# Altium schematic sheet Makit_Car_Kit.SchDoc (part 3 of 3)
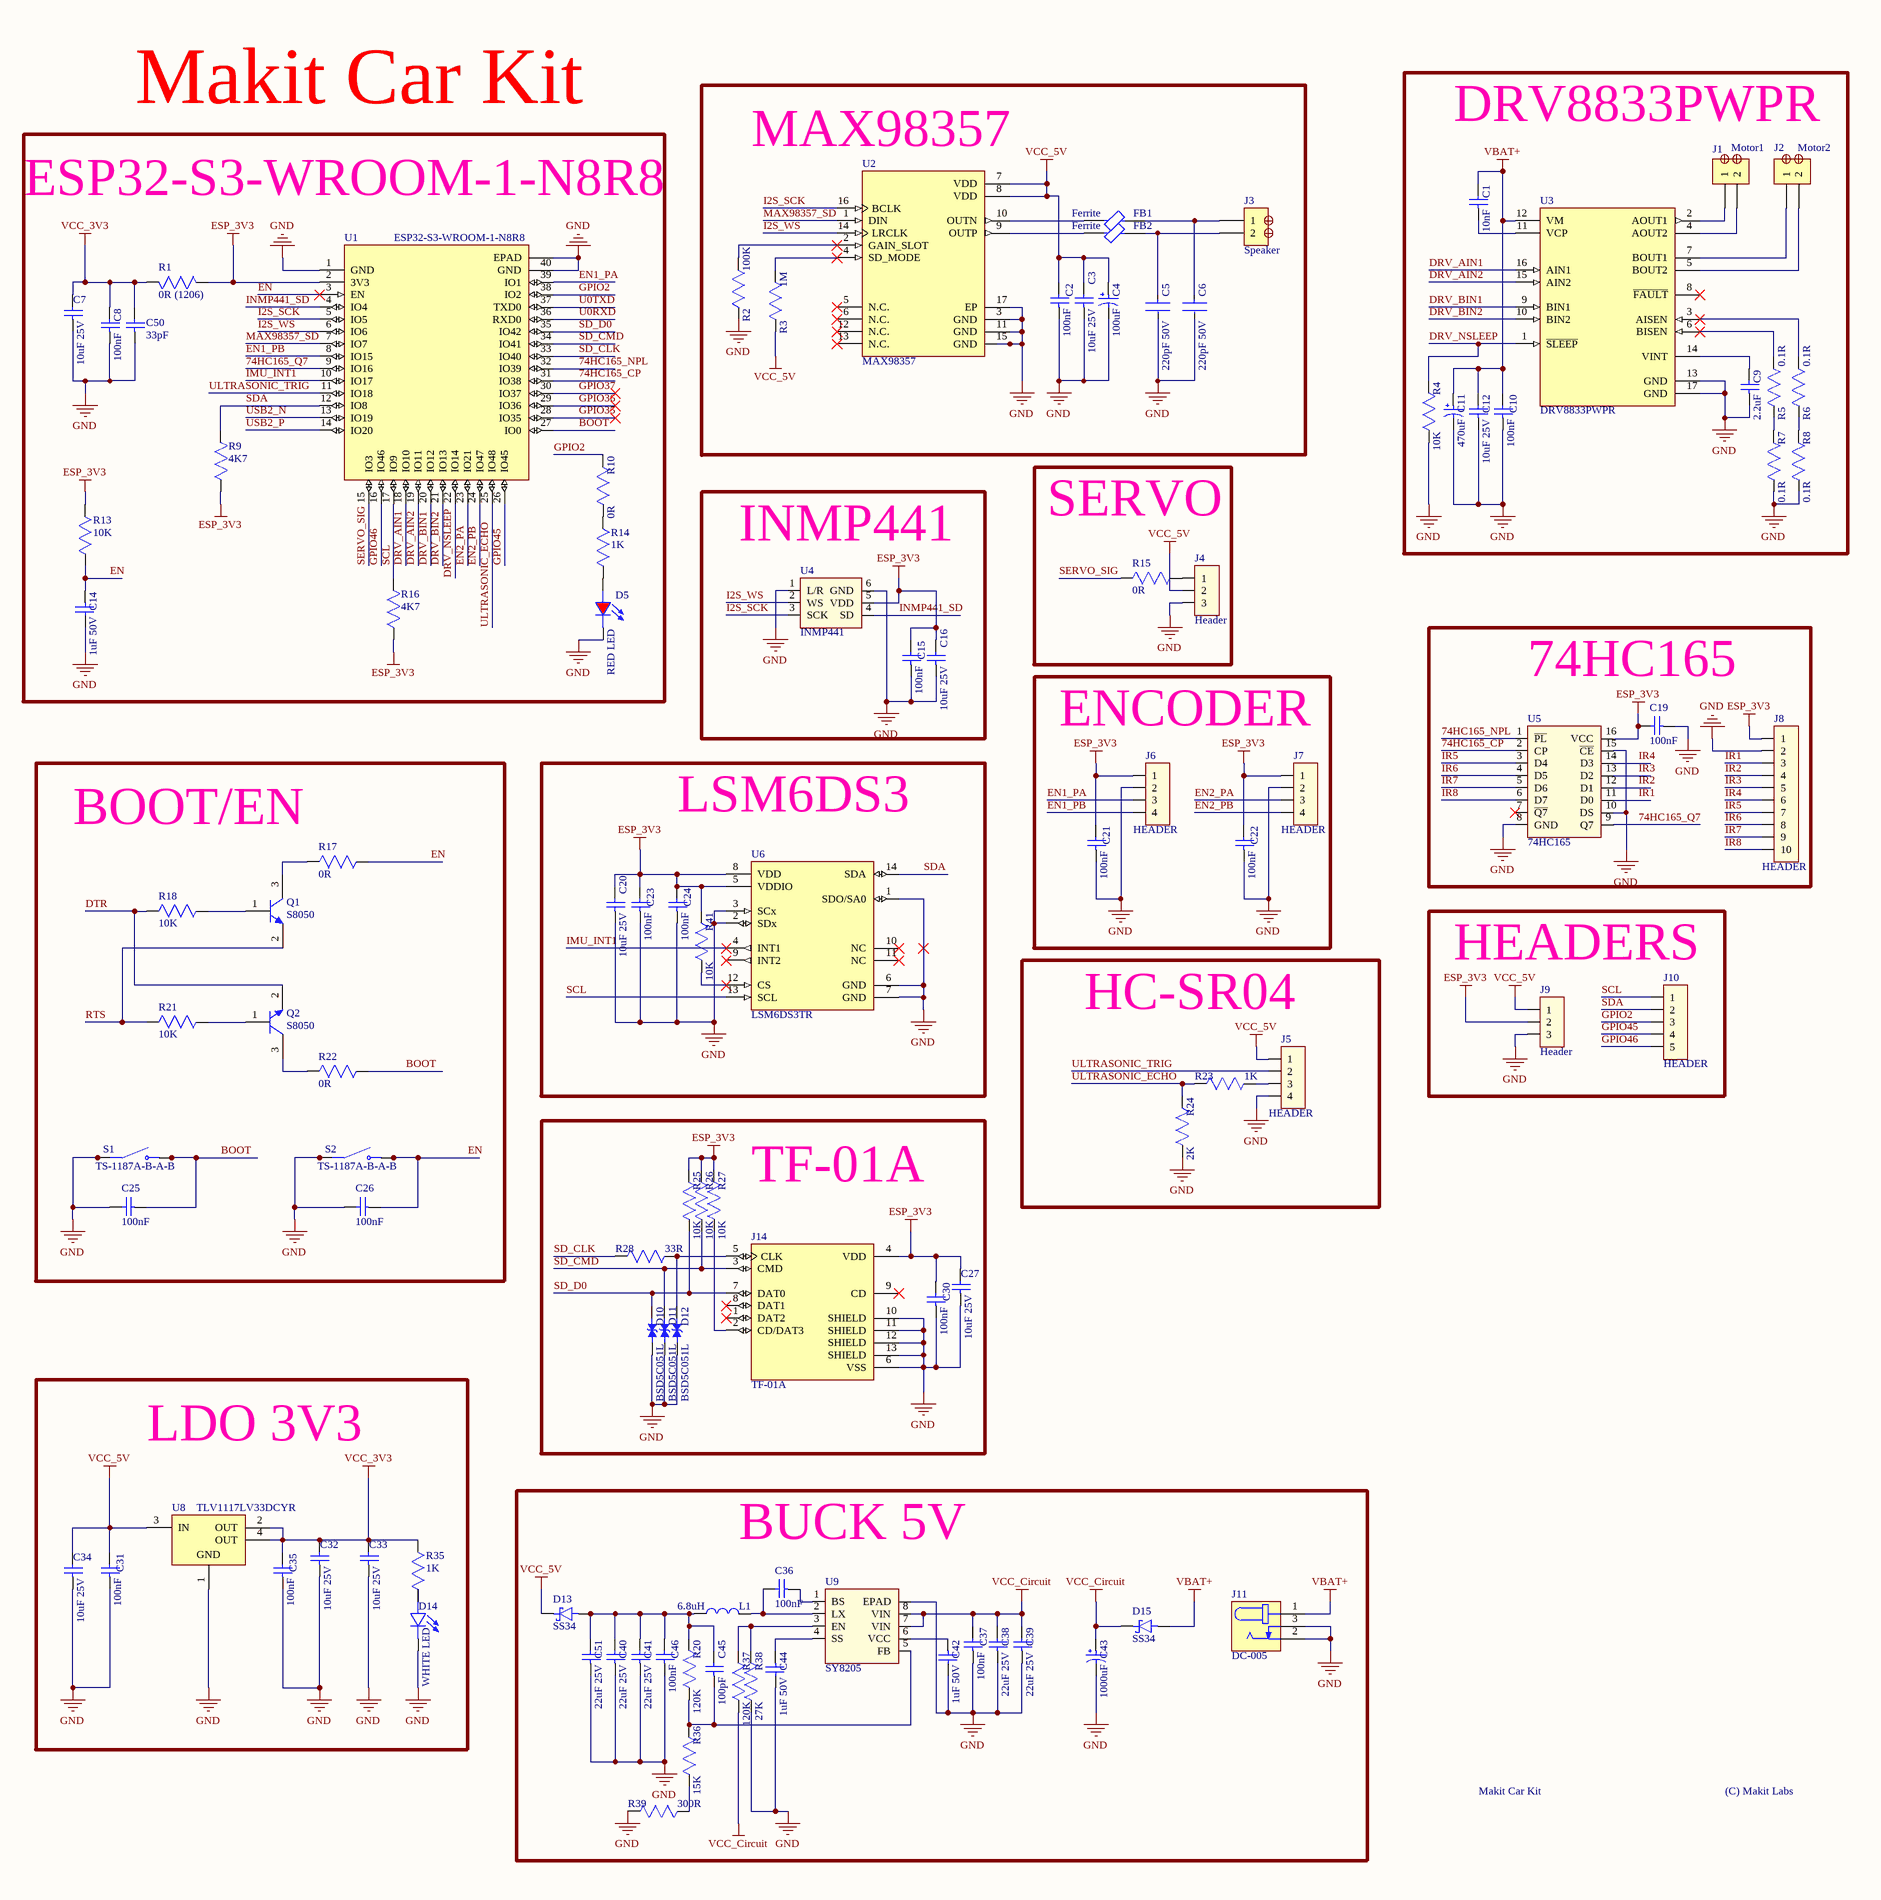
[diagram p3: Makit_Car_Kit.SchDoc, right]

## Library data of the parts (continued)
C50 = CL10C330JB8NNNC: Multilayer Ceramic Capacitor, 33 pF, 50 V, ± 5%, C0G (NP0), 0603 [1608 Metric]; Manufacturer: Samsung Electro-Mechanics; Temperature Coefficient: 30ppm/°C; Voltage: 50V; Supplier: Avnet; Supplier Part Number: CL10C330JB8NNNC; Manufacturer Part Number: CL10C330JB8NNNC; RoHS: Compliant; Category: Ceramic Capacitors; Stock: 164000; Pricing: 4000=0.00469, 8000=0.0046, 16000=0.00451, 32000=0.00442, 64000=0.00434 (USD); Value: 33pF; Case/Package: 0603; Case Code (Imperial): 0603; Case Code (Metric): 1608; China RoHS: Compliant; Contact Plating: Tin; Country of Origin: Mainland China, Philippines, South Korea; Depth: 800µm; Dielectric: C0G; Dielectric Material: Ceramic; Export Control Classification Number (ECCN) Code: EAR99; Height: 900µm; Harmonized Tariff Schedule (HTS) Code: 8532.24.00.20; Introduction Date: 2010-02-10; Lead Free: Lead Free; Length: 1.6mm; Lifecycle Status: Production; Material: Ceramic; Max Operating Temperature: 125°C; Min Operating Temperature: -55°C; Mounting Technology: Surface Mount; Number of Terminals: 2; Radiation Hardening: No; REACH SVHC: Yes; Schedule B: 8532240020, 8532240020|8532240020|8532240020|8532240020|8532240020; Thickness: 889µm; Tolerance: 5%; Voltage Rating: 50V; Voltage Rating (DC): 50V; Width: 800µm; ComponentLink1URL: https://datasheet.octopart.com:443/CL10C330JB8NNNC-Samsung-Electro-Mechanics-datasheet-136482426.pdf?src-supplier=IHS; ComponentLink1Description: https://datasheet.octopart.com:443/CL10C330JB8NNNC-Samsung-Electro-Mechanics-datasheet-136482426.pdf?src-supplier=IHS; ComponentLink2URL: https://datasheet.octopart.com/CL10C330JB8NNNC-Samsung-Electro-Mechanics-datasheet-8324245.pdf; ComponentLink2Description: https://datasheet.octopart.com/CL10C330JB8NNNC-Samsung-Electro-Mechanics-datasheet-8324245.pdf; ComponentLink3URL: https://datasheet.octopart.com/CL10C330JB8NNNC-Samsung-Electro-Mechanics-datasheet-97040617.pdf; ComponentLink3Description: https://datasheet.octopart.com/CL10C330JB8NNNC-Samsung-Electro-Mechanics-datasheet-97040617.pdf; ComponentLink4URL: https://datasheet.octopart.com:443/CL10C330JB8NNNC-Samsung-Electro-Mechanics-datasheet-110226363.pdf?src-supplier=Future+Electronics; ComponentLink4Description: https://datasheet.octopart.com:443/CL10C330JB8NNNC-Samsung-Electro-Mechanics-datasheet-110226363.pdf?src-supplier=Future+Electronics; ComponentLink5URL: https://datasheet.octopart.com:443/CL10C330JB8NNNC-Samsung-Electro-Mechanics-datasheet-81462031.pdf?src-supplier=Future+Electronics; ComponentLink5Description: https://datasheet.octopart.com:443/CL10C330JB8NNNC-Samsung-Electro-Mechanics-datasheet-81462031.pdf?src-supplier=Future+Electronics; ComponentLink6URL: https://datasheet.octopart.com:443/CL10C330JB8NNNC-Samsung-datasheet-42280639.pdf?src-supplier=Future+Electronics; ComponentLink6Description: https://datasheet.octopart.com:443/CL10C330JB8NNNC-Samsung-datasheet-42280639.pdf?src-supplier=Future+Electronics; ComponentLink7URL: https://datasheet.octopart.com:443/CL10C330JB8NNNC-Samsung-datasheet-26669168.pdf?src-supplier=Future+Electronics; ComponentLink7Description: https://datasheet.octopart.com:443/CL10C330JB8NNNC-Samsung-datasheet-26669168.pdf?src-supplier=Future+Electronics; ComponentLink8URL: https://datasheet.octopart.com:443/CL10C330JB8NNNC-Samsung-Electro-Mechanics-datasheet-149136915.pdf?src-supplier=Future+Electronics; ComponentLink8Description: https://datasheet.octopart.com:443/CL10C330JB8NNNC-Samsung-Electro-Mechanics-datasheet-149136915.pdf?src-supplier=Future+Electronics; ComponentLink9URL: https://datasheet.octopart.com:443/CL10C330JB8NNNC-Samsung-datasheet-8326407.pdf?src-supplier=TME; ComponentLink9Description: https://datasheet.octopart.com:443/CL10C330JB8NNNC-Samsung-datasheet-8326407.pdf?src-supplier=TME; JLCPCB Part Number: C1663
D2-D4 D10-D12 = BSD5C051L: 1 13V 150nA 2.5pF 3A@8/20us 5V 6V Bidirectional ESD IEC 61000-4-2、IEC 61000-4-5、IEC 61000-4-4 SOD-523 ESD and Surge Protection (TVS/ESD) ROHS; MF: Leshan Radio Co.; Check_prices: https://www.snapeda.com/parts/LESD5D5.0CT1G/Leshan+Radio+Co./view-part/?ref=eda; Value: *; Availability: Not in stock; Package: None; SnapEDA_Link: https://www.snapeda.com/parts/LESD5D5.0CT1G/Leshan+Radio+Co./view-part/?ref=snap; MP: BSD5C051L; Price: None; JLCPCB Part Number: C151983
D5 = KT-0603R: Red 0603 Light Emitting Diodes; MF: Hubei KENTO Elec; SnapEDA_Link: https://www.snapeda.com/parts/KT-0603R/Hubei+KENTO+Elec/view-part/?ref=snap; Package: Package; MP: KT-0603R; Check_prices: https://www.snapeda.com/parts/KT-0603R/Hubei+KENTO+Elec/view-part/?ref=eda; JLCPCB Part Number: C2286; Value: *
D14 = KT-0603W: White 0603 Light Emitting Diodes; MF: Hubei KENTO Elec; SnapEDA_Link: https://www.snapeda.com/parts/KT-0603R/Hubei+KENTO+Elec/view-part/?ref=snap; Package: Package; MP: KT-0603W; Check_prices: https://www.snapeda.com/parts/KT-0603R/Hubei+KENTO+Elec/view-part/?ref=eda; JLCPCB Part Number: C2290; Value: *
FB1 FB2 = CMP-0686-00557-7: Chip Ferrite Bead, 0603, 120Ω @ 100MHz, 0.05Ω, 25%, 2A; Manufacturer Part Number: BLM18PG121SN1D; Impedance: 120R; Number of Circuits: 1; Shielding: Unshielded; Material: Steel; DC Resistance (DCR): 50mR; Case Code (Imperial): 0603; RoHS Compliant: Yes; Number of Pins: 2; Min Operating Temperature: -55°C; Case Code (Metric): 1608; Frequency: 100MHz; Length: 1.6mm; Test Frequency: 100MHz; Max Operating Temperature: 125°C; Packaging: Tape and Reel; Max Current Rating: 2A; Termination: SMD/SMT; Lead Free: Lead Free; Max DC Current: 2A; Case/Package: 0603; Height: 0.8mm; Current Rating: 2A; Radiation Hardening: No; Core Material: Ferrite; DC Current: 2A; REACH SVHC: No SVHC; Package Quantity: 1; Depth: 0.8mm; Number of Lines: 1; Tolerance: 25%; Width: 0.8mm; JLCPCB Part Number: C14709
J1-J3 = 282837-2: Connector, Terminal Block; Wire Receptacle; 2 Pos.; 16-30 AWG; 0.2 in. CL; Side;; Manufacturer: TE Connectivity; Manufacturer Lifecycle Status: ACTIVE; Approvals: UL; Connector System: Wire-to-Board; Current: 13.5A; Gender: Female; Max Supply Voltage (AC): 250V; Number of Circuits: 2; Number of Levels: 1; Operating Supply Voltage: 300V; Pitch: 5.08mm; Plating: Brass; Tail Length: 3.5mm; Thread Size: M3; Wire/Cable Gauge: 15AWG; Wire Gauge (Max): 28AWG; Wire Gauge (Min): 16AWG; Supplier: Future Electronics; Supplier Part Number: 6910608; Manufacturer Part Number: 282837-2; RoHS: Compliant; Category: Terminal Blocks; Stock: 9; Pricing: 50=0.355, 125=0.345, 250=0.34, 750=0.335, 1500=0.325 (USD); China RoHS: Non-Compliant; Color: Green; Connector Type: Receptacle; Contact Material: Brass; Contact Plating: Tin; Current Rating: 13.5A; Depth: 8.2mm; Export Control Classification Number (ECCN) Code: EAR99; ELV: Compliant; Flammability Rating: UL94 V-0; Height: 10.3mm; Housing Color: Green; Housing Material: Polyamide; Harmonized Tariff Schedule (HTS) Code: 8536.90.40.00; Introduction Date: 1997-11-01; Lead Free: Lead Free; Lifecycle Status: Production; Max Current Rating: 13.5A; Max Operating Temperature: 110°C; Max Voltage Rating (AC): 250V; Min Operating Temperature: -40°C; Mounting Technology: Screw; Number of Contacts: 2; Pins: 2; Number of Poles: 2; Number of Positions: 2; Number of Positions Per Level: 2; Number of Rows: 1; Orientation: Straight; Packaging: Bulk; Radiation Hardening: No; REACH SVHC: No; Termination: Solder; Voltage: 300V; Voltage Rating: 300V; Voltage Rating (AC): 250V; Width: 11.5mm; ComponentLink1URL: https://datasheet.octopart.com:443/282837-2-TE-Connectivity-datasheet-11084709.pdf?src-supplier=Electro+Sonic; ComponentLink1Description: https://datasheet.octopart.com:443/282837-2-TE-Connectivity-datasheet-11084709.pdf?src-supplier=Electro+Sonic; ComponentLink2URL: https://datasheet.octopart.com:443/282837-2-TE-Connectivity-datasheet-180047323.pdf?src-supplier=IHS; ComponentLink2Description: https://datasheet.octopart.com:443/282837-2-TE-Connectivity-datasheet-180047323.pdf?src-supplier=IHS; ComponentLink3URL: https://datasheet.octopart.com:443/282837-2-TE-Connectivity---AMP-datasheet-181444653.pdf?src-supplier=IHS; ComponentLink3Description: https://datasheet.octopart.com:443/282837-2-TE-Connectivity---AMP-datasheet-181444653.pdf?src-supplier=IHS; ComponentLink4URL: https://sigma.octopart.com:443/136669779/technical_drawing/TE-Connectivity-282837-2.pdf?src-supplier=Sager+Electronics; ComponentLink4Description: https://sigma.octopart.com:443/136669779/technical_drawing/TE-Connectivity-282837-2.pdf?src-supplier=Sager+Electronics; ComponentLink5URL: https://datasheet.octopart.com:443/282837-2-TE-Connectivity-datasheet-12103319.pdf?src-supplier=element14+APAC; ComponentLink5Description: https://datasheet.octopart.com:443/282837-2-TE-Connectivity-datasheet-12103319.pdf?src-supplier=element14+APAC; ComponentLink6URL: https://sigma.octopart.com:443/14765542/technical_drawing/TE-Connectivity-282837-2.pdf?src-supplier=TE+Connectivity; ComponentLink6Description: https://sigma.octopart.com:443/14765542/technical_drawing/TE-Connectivity-282837-2.pdf?src-supplier=TE+Connectivity; ComponentLink7URL: https://datasheet.octopart.com:443/282837-2-Agastat-datasheet-13560836.pdf?src-supplier=TE+Connectivity; ComponentLink7Description: https://datasheet.octopart.com:443/282837-2-Agastat-datasheet-13560836.pdf?src-supplier=TE+Connectivity; ComponentLink8URL: https://datasheet.octopart.com:443/282837-2-TE-Connectivity-datasheet-164883459.pdf?src-supplier=Burklin+Elektronik; ComponentLink8Description: https://datasheet.octopart.com:443/282837-2-TE-Connectivity-datasheet-164883459.pdf?src-supplier=Burklin+Elektronik; ComponentLink9URL: https://datasheet.octopart.com:443/282837-2-TE-Connectivity-datasheet-20824500.pdf?src-supplier=RS+(Formerly+Allied+Electronics); ComponentLink9Description: https://datasheet.octopart.com:443/282837-2-TE-Connectivity-datasheet-20824500.pdf?src-supplier=RS+(Formerly+Allied+Electronics); ComponentLink10URL: https://datasheet.octopart.com:443/282837-2-Tyco-Electronics-datasheet-9638290.pdf?src-supplier=RS+(Formerly+Allied+Electronics); ComponentLink10Description: https://datasheet.octopart.com:443/282837-2-Tyco-Electronics-datasheet-9638290.pdf?src-supplier=RS+(Formerly+Allied+Electronics); ComponentLink11URL: https://datasheet.octopart.com:443/282837-2-Tyco-Electronics-datasheet-60025.pdf?src-supplier=RS+(Formerly+Allied+Electronics); ComponentLink11Description: https://datasheet.octopart.com:443/282837-2-Tyco-Electronics-datasheet-60025.pdf?src-supplier=RS+(Formerly+Allied+Electronics); ComponentLink12URL: https://datasheet.octopart.com:443/282837-2-TE-Connectivity---AMP-datasheet-189108469.pdf?src-supplier=Master+Electronics; ComponentLink12Description: https://datasheet.octopart.com:443/282837-2-TE-Connectivity---AMP-datasheet-189108469.pdf?src-supplier=Master+Electronics; ComponentLink13URL: https://datasheet.octopart.com:443/282837-2-TE-Connectivity-datasheet-7829509.pdf?src-supplier=Jameco; ComponentLink13Description: https://datasheet.octopart.com:443/282837-2-TE-Connectivity-datasheet-7829509.pdf?src-supplier=Jameco; ComponentLink14URL: http://sigma.octopart.com:80/38876000/materials_sheet/TE-Connectivity-282837-2.pdf?src-supplier=Compliance+Statements; ComponentLink14Description: http://sigma.octopart.com:80/38876000/materials_sheet/TE-Connectivity-282837-2.pdf?src-supplier=Compliance+Statements; ComponentLink15URL: http://sigma.octopart.com:80/117256993/reach_statement/TE-Connectivity-282837-2.pdf?src-supplier=Compliance+Statements; ComponentLink15Description: http://sigma.octopart.com:80/117256993/reach_statement/TE-Connectivity-282837-2.pdf?src-supplier=Compliance+Statements; ComponentLink16URL: http://sigma.octopart.com:80/136730121/materials_sheet/TE-Connectivity-282837-2.pdf?src-supplier=Compliance+Statements; ComponentLink16Description: http://sigma.octopart.com:80/136730121/materials_sheet/TE-Connectivity-282837-2.pdf?src-supplier=Compliance+Statements; ComponentLink17URL: http://sigma.octopart.com:80/14765540/rohs_certificate/Agastat-282837-2.pdf?src-supplier=Compliance+Statements; ComponentLink17Description: http://sigma.octopart.com:80/14765540/rohs_certificate/Agastat-282837-2.pdf?src-supplier=Compliance+Statements
J4 J9 = HEADER X3
J5-J7 = HEADER X4
J8 = HEADER X10
J10 = HEADER X5
J11 = DC-005: DC Jack; Availability: Unavailable; MP: DC-005; Value: *; Package: None; Price: None
J12 = TYPE-C-31-M-12: -30℃~+80℃ 1 10,000 cycles 16P 20V 5A 7.35mm Female Surface Mount, Right Angle Type-C SMD USB Connectors ROHS; JLCPCB Part Number: C165948; Manufacturer Part Number: TYPE-C-31-M-12
J14 = TF-01A: Standard Card Edge Connectors; MF: HRO Electronics Co., Ltd.; Price: None; Availability: Not in stock; MP: TF-01A; Package: Package; SnapEDA_Link: https://www.snapeda.com/parts/TF-01A/HRO+Electronics+Co.%252C+Ltd./view-part/?ref=snap; Check_prices: https://www.snapeda.com/parts/TF-01A/HRO+Electronics+Co.%252C+Ltd./view-part/?ref=eda; Value: *; Manufacturer_Part_Number: TF-01A; JLCPCB Part Number: C91145
L1 = CYA0650-6.8UH: Manufacturer_Part_Number: CYA0650-6.8UH; Package: SMD,7.2x6.6mm; JLCPCB Part Number: C5189755; Value: 6.8uH
Q1 Q2 = S8050: -55℃~+150℃ 1 NPN 100nA 150MHz 200 25V 300mW 500mA 5V 600mV NPN SOT-23 Bipolar (BJT) ROHS; Package: SOT-23; JLCPCB Part Number: C2146
R1 = CR1206-J-000ELF: -55℃~+155℃ 0Ω 200V 250mW Thick Film Resistor ±1% ±800ppm/℃ 1206 Chip Resistor - Surface Mount ROHS; Manufacturer_Name: Bourns Electronics; Manufacturer_Part_Number: CR1206-J/-000ELF; Copyright: Copyright (C) 2025 Ultra Librarian. All rights reserved.; JLCPCB Part Number: C17888; Value: 0R
R2 = 0603WAF1003T5E: Res Thick Film 0603 100K Ohm 1% 0.1W(1/10W) ±100ppm/C Pad SMD T/R; Manufacturer: Royal Ohm; Value: 100kΩ; Supplier: Mouser; Supplier Part Number: 303-0603WAF1003T5E; Manufacturer Part Number: 0603WAF1003T5E; Category: Uncategorized; Stock: 180000; Pricing: 10000=0.001 (USD); ComponentLink1URL: https://datasheet.octopart.com:443/0603WAF1003T5E-Royal-Ohm-datasheet-165785611.pdf?src-supplier=TME; ComponentLink1Description: https://datasheet.octopart.com:443/0603WAF1003T5E-Royal-Ohm-datasheet-165785611.pdf?src-supplier=TME; ComponentLink2URL: https://datasheet.octopart.com:443/0603WAF1003T5E-Royal-Ohm-datasheet-157855877.pdf?src-supplier=TME; ComponentLink2Description: https://datasheet.octopart.com:443/0603WAF1003T5E-Royal-Ohm-datasheet-157855877.pdf?src-supplier=TME; ComponentLink3URL: https://datasheet.octopart.com:443/0603WAF1003T5E-Royal-Ohm-datasheet-62069544.pdf?src-supplier=TME; ComponentLink3Description: https://datasheet.octopart.com:443/0603WAF1003T5E-Royal-Ohm-datasheet-62069544.pdf?src-supplier=TME; Package: 0603; JLCPCB Part Number: C25803
R3 = 0603WAF1004T5E: Thick Film Resistors - SMD RMC 0603 1/10W 1% T/R-5000; Manufacturer: Royal Ohm; Value: 1MΩ; Supplier: Mouser; Supplier Part Number: 303-0603WAF1004T5E; Manufacturer Part Number: 0603WAF1004T5E; Category: Uncategorized; Stock: 65000; Pricing: 10000=0.001 (USD); ComponentLink1URL: https://datasheet.octopart.com:443/0603WAF1004T5E-Royal-Ohm-datasheet-165785611.pdf?src-supplier=TME; ComponentLink1Description: https://datasheet.octopart.com:443/0603WAF1004T5E-Royal-Ohm-datasheet-165785611.pdf?src-supplier=TME; ComponentLink2URL: https://datasheet.octopart.com:443/0603WAF1004T5E-Royal-Ohm-datasheet-157855877.pdf?src-supplier=TME; ComponentLink2Description: https://datasheet.octopart.com:443/0603WAF1004T5E-Royal-Ohm-datasheet-157855877.pdf?src-supplier=TME; ComponentLink3URL: https://datasheet.octopart.com:443/0603WAF1004T5E-Royal-Ohm-datasheet-62069544.pdf?src-supplier=TME; ComponentLink3Description: https://datasheet.octopart.com:443/0603WAF1004T5E-Royal-Ohm-datasheet-62069544.pdf?src-supplier=TME; Package: 0603; JLCPCB Part Number: C22935
R4 R13 R18 R21 R25-R27 R30 R41 = 0603WAF1002T5E: Res Thick Film 0603 10K Ohm 1% 0.1W(1/10W) ±100ppm/C Pad SMD; Manufacturer: Royal Ohm; Value: 10kΩ; Supplier: Mouser; Supplier Part Number: 303-0603WAF1002T5E; Manufacturer Part Number: 0603WAF1002T5E; Category: Uncategorized; Stock: 375000; Pricing: 10000=0.001 (USD); ComponentLink1URL: https://datasheet.octopart.com:443/0603WAF1002T5E-Royal-Ohm-datasheet-165785611.pdf?src-supplier=TME; ComponentLink1Description: https://datasheet.octopart.com:443/0603WAF1002T5E-Royal-Ohm-datasheet-165785611.pdf?src-supplier=TME; ComponentLink2URL: https://datasheet.octopart.com:443/0603WAF1002T5E-Royal-Ohm-datasheet-157855877.pdf?src-supplier=TME; ComponentLink2Description: https://datasheet.octopart.com:443/0603WAF1002T5E-Royal-Ohm-datasheet-157855877.pdf?src-supplier=TME; ComponentLink3URL: https://datasheet.octopart.com:443/0603WAF1002T5E-Royal-Ohm-datasheet-62069544.pdf?src-supplier=TME; ComponentLink3Description: https://datasheet.octopart.com:443/0603WAF1002T5E-Royal-Ohm-datasheet-62069544.pdf?src-supplier=TME; Package: 0603; JLCPCB Part Number: C25804
R5-R8 = 1206W4F100LT5E: 250mW Thick Film Resistors 200V ±800ppm/℃ ±1% 100mΩ 1206 Chip Resistor - Surface Mount ROHS; Manufacturer: Royal Ohm; Supplier: Mouser; Supplier Part Number: 303-1206W4F100LT5E; Manufacturer Part Number: 1206W4F100LT5E; Category: Uncategorized; Pricing: 10000=0.021 (USD); Value: 100mΩ; ComponentLink1URL: https://datasheet.octopart.com:443/1206W4F100LT5E-Royal-Ohm-datasheet-165785611.pdf?src-supplier=TME; ComponentLink1Description: https://datasheet.octopart.com:443/1206W4F100LT5E-Royal-Ohm-datasheet-165785611.pdf?src-supplier=TME; ComponentLink2URL: https://datasheet.octopart.com:443/1206W4F100LT5E-Royal-Ohm-datasheet-62069544.pdf?src-supplier=TME; ComponentLink2Description: https://datasheet.octopart.com:443/1206W4F100LT5E-Royal-Ohm-datasheet-62069544.pdf?src-supplier=TME; Package: 1206; JLCPCB Part Number: C25334
R9 R16 = 0603WAF4701T5E: 100mW Thick Film Resistors 75V ±100ppm/℃ ±1% 4.7kΩ 0603 Chip Resistor - Surface Mount ROHS; Manufacturer: Royal Ohm; Supplier: Mouser; Supplier Part Number: 303-0603WAF4701T5E; Manufacturer Part Number: 0603WAF4701T5E; Category: Uncategorized; Stock: 165000; Pricing: 10000=0.001 (USD); Value: 4.7kΩ; ComponentLink1URL: https://datasheet.octopart.com:443/0603WAF4701T5E-Royal-Ohm-datasheet-165785611.pdf?src-supplier=TME; ComponentLink1Description: https://datasheet.octopart.com:443/0603WAF4701T5E-Royal-Ohm-datasheet-165785611.pdf?src-supplier=TME; ComponentLink2URL: https://datasheet.octopart.com:443/0603WAF4701T5E-Royal-Ohm-datasheet-157855877.pdf?src-supplier=TME; ComponentLink2Description: https://datasheet.octopart.com:443/0603WAF4701T5E-Royal-Ohm-datasheet-157855877.pdf?src-supplier=TME; ComponentLink3URL: https://datasheet.octopart.com:443/0603WAF4701T5E-Royal-Ohm-datasheet-62069544.pdf?src-supplier=TME; ComponentLink3Description: https://datasheet.octopart.com:443/0603WAF4701T5E-Royal-Ohm-datasheet-62069544.pdf?src-supplier=TME; Package: 0603; JLCPCB Part Number: C23162
R10 R15 R17 R22 R31 R34 = 0603WAF0000T5E: Thick Film Resistors - SMD RMC 0603 1/10W 1% T/R-5000; Manufacturer: Royal Ohm; Value: 0Ω; Supplier: Mouser; Supplier Part Number: 303-0603WAF0000T5E; Manufacturer Part Number: 0603WAF0000T5E; Category: Uncategorized; Stock: 140000; Pricing: 10000=0.001 (USD); ComponentLink1URL: https://datasheet.octopart.com:443/0603WAF0000T5E-Royal-Ohm-datasheet-165785611.pdf?src-supplier=TME; ComponentLink1Description: https://datasheet.octopart.com:443/0603WAF0000T5E-Royal-Ohm-datasheet-165785611.pdf?src-supplier=TME; ComponentLink2URL: https://datasheet.octopart.com:443/0603WAF0000T5E-Royal-Ohm-datasheet-157855877.pdf?src-supplier=TME; ComponentLink2Description: https://datasheet.octopart.com:443/0603WAF0000T5E-Royal-Ohm-datasheet-157855877.pdf?src-supplier=TME; ComponentLink3URL: https://datasheet.octopart.com:443/0603WAF0000T5E-Royal-Ohm-datasheet-62069544.pdf?src-supplier=TME; ComponentLink3Description: https://datasheet.octopart.com:443/0603WAF0000T5E-Royal-Ohm-datasheet-62069544.pdf?src-supplier=TME; Package: 0603; JLCPCB Part Number: C21189
R11 R12 R19 = 0603WAF5101T5E: Res Thick Film 0603 5.1K Ohm 1% 0.1W(1/10W) ±100ppm/C Pad SMD T/R; Manufacturer: Royal Ohm; Value: 5.1kΩ; Supplier: Mouser; Supplier Part Number: 303-0603WAF5101T5E; Manufacturer Part Number: 0603WAF5101T5E; Category: Uncategorized; Stock: 20000; Pricing: 10000=0.001 (USD); ComponentLink1URL: https://datasheet.octopart.com:443/0603WAF5101T5E-Royal-Ohm-datasheet-165785611.pdf?src-supplier=TME; ComponentLink1Description: https://datasheet.octopart.com:443/0603WAF5101T5E-Royal-Ohm-datasheet-165785611.pdf?src-supplier=TME; ComponentLink2URL: https://datasheet.octopart.com:443/0603WAF5101T5E-Royal-Ohm-datasheet-157855877.pdf?src-supplier=TME; ComponentLink2Description: https://datasheet.octopart.com:443/0603WAF5101T5E-Royal-Ohm-datasheet-157855877.pdf?src-supplier=TME; ComponentLink3URL: https://datasheet.octopart.com:443/0603WAF5101T5E-Royal-Ohm-datasheet-62069544.pdf?src-supplier=TME; ComponentLink3Description: https://datasheet.octopart.com:443/0603WAF5101T5E-Royal-Ohm-datasheet-62069544.pdf?src-supplier=TME; Package: 0603; JLCPCB Part Number: C23186
R14 R23 R29 R35 = 0603WAF1001T5E: Res Thick Film 0603 1K Ohm 1% 0.1W(1/10W) ±100ppm/C Pad SMD T/R; Manufacturer: Royal Ohm; Value: 1kΩ; Supplier: Mouser; Supplier Part Number: 303-0603WAF1001T5E; Manufacturer Part Number: 0603WAF1001T5E; Category: Uncategorized; Stock: 275000; Pricing: 10000=0.001 (USD); ComponentLink1URL: https://datasheet.octopart.com:443/0603WAF1001T5E-Royal-Ohm-datasheet-165785611.pdf?src-supplier=TME; ComponentLink1Description: https://datasheet.octopart.com:443/0603WAF1001T5E-Royal-Ohm-datasheet-165785611.pdf?src-supplier=TME; ComponentLink2URL: https://datasheet.octopart.com:443/0603WAF1001T5E-Royal-Ohm-datasheet-157855877.pdf?src-supplier=TME; ComponentLink2Description: https://datasheet.octopart.com:443/0603WAF1001T5E-Royal-Ohm-datasheet-157855877.pdf?src-supplier=TME; ComponentLink3URL: https://datasheet.octopart.com:443/0603WAF1001T5E-Royal-Ohm-datasheet-62069544.pdf?src-supplier=TME; ComponentLink3Description: https://datasheet.octopart.com:443/0603WAF1001T5E-Royal-Ohm-datasheet-62069544.pdf?src-supplier=TME; Package: 0603; JLCPCB Part Number: C21190
R20 R37 = 0603WAF1203T5E: 100mW Thick Film Resistors 75V ±100ppm/℃ ±1% 120kΩ 0603 Chip Resistor - Surface Mount ROHS; Manufacturer: Royal Ohm; Supplier: Mouser; Supplier Part Number: 303-0603WAF1203T5E; Manufacturer Part Number: 0603WAF1203T5E; Category: Uncategorized; Stock: 170000; Pricing: 10000=0.001 (USD); Value: 120kΩ; ComponentLink1URL: https://datasheet.octopart.com:443/0603WAF1203T5E-Royal-Ohm-datasheet-165785611.pdf?src-supplier=TME; ComponentLink1Description: https://datasheet.octopart.com:443/0603WAF1203T5E-Royal-Ohm-datasheet-165785611.pdf?src-supplier=TME; ComponentLink2URL: https://datasheet.octopart.com:443/0603WAF1203T5E-Royal-Ohm-datasheet-157855877.pdf?src-supplier=TME; ComponentLink2Description: https://datasheet.octopart.com:443/0603WAF1203T5E-Royal-Ohm-datasheet-157855877.pdf?src-supplier=TME; ComponentLink3URL: https://datasheet.octopart.com:443/0603WAF1203T5E-Royal-Ohm-datasheet-62069544.pdf?src-supplier=TME; ComponentLink3Description: https://datasheet.octopart.com:443/0603WAF1203T5E-Royal-Ohm-datasheet-62069544.pdf?src-supplier=TME; Package: 0603; JLCPCB Part Number: C25808
R24 = 0603WAF2001T5E: Manufacturer: Royal Ohm; Value: 2kΩ; Supplier: Mouser; Supplier Part Number: 303-0603WAF2001T5E; Manufacturer Part Number: 0603WAF2001T5E; Category: Uncategorized; Stock: 60000; Pricing: 10000=0.001 (USD); ComponentLink1URL: https://datasheet.octopart.com:443/0603WAF2001T5E-Royal-Ohm-datasheet-165785611.pdf?src-supplier=TME; ComponentLink1Description: https://datasheet.octopart.com:443/0603WAF2001T5E-Royal-Ohm-datasheet-165785611.pdf?src-supplier=TME; ComponentLink2URL: https://datasheet.octopart.com:443/0603WAF2001T5E-Royal-Ohm-datasheet-157855877.pdf?src-supplier=TME; ComponentLink2Description: https://datasheet.octopart.com:443/0603WAF2001T5E-Royal-Ohm-datasheet-157855877.pdf?src-supplier=TME; ComponentLink3URL: https://datasheet.octopart.com:443/0603WAF2001T5E-Royal-Ohm-datasheet-62069544.pdf?src-supplier=TME; ComponentLink3Description: https://datasheet.octopart.com:443/0603WAF2001T5E-Royal-Ohm-datasheet-62069544.pdf?src-supplier=TME; Package: 0603; JLCPCB Part Number: C22975
R28 = 0603WAF330JT5E: Thick Film Resistors - SMD RMC 0603 1/10W 1% T/R-5000; Manufacturer: Royal Ohm; Value: 33Ω; Supplier: Mouser; Supplier Part Number: 303-0603WAF330JT5E; Manufacturer Part Number: 0603WAF330JT5E; Category: Uncategorized; Stock: 55000; Pricing: 10000=0.001 (USD); ComponentLink1URL: https://datasheet.octopart.com:443/0603WAF330JT5E-Royal-Ohm-datasheet-165785611.pdf?src-supplier=TME; ComponentLink1Description: https://datasheet.octopart.com:443/0603WAF330JT5E-Royal-Ohm-datasheet-165785611.pdf?src-supplier=TME; ComponentLink2URL: https://datasheet.octopart.com:443/0603WAF330JT5E-Royal-Ohm-datasheet-157855877.pdf?src-supplier=TME; ComponentLink2Description: https://datasheet.octopart.com:443/0603WAF330JT5E-Royal-Ohm-datasheet-157855877.pdf?src-supplier=TME; ComponentLink3URL: https://datasheet.octopart.com:443/0603WAF330JT5E-Royal-Ohm-datasheet-62069544.pdf?src-supplier=TME; ComponentLink3Description: https://datasheet.octopart.com:443/0603WAF330JT5E-Royal-Ohm-datasheet-62069544.pdf?src-supplier=TME; Package: 0603; JLCPCB Part Number: C23140
R32 = 0603WAF2202T5E: Res Thick Film 0603 22K Ohm 1% 0.1W(1/10W) ±100ppm/C Pad SMD T/R; Manufacturer: Royal Ohm; Value: 22kΩ; Supplier: Mouser; Supplier Part Number: 303-0603WAF2202T5E; Manufacturer Part Number: 0603WAF2202T5E; Category: Uncategorized; Stock: 70000; Pricing: 10000=0.001 (USD); ComponentLink1URL: https://datasheet.octopart.com:443/0603WAF2202T5E-Royal-Ohm-datasheet-165785611.pdf?src-supplier=TME; ComponentLink1Description: https://datasheet.octopart.com:443/0603WAF2202T5E-Royal-Ohm-datasheet-165785611.pdf?src-supplier=TME; ComponentLink2URL: https://datasheet.octopart.com:443/0603WAF2202T5E-Royal-Ohm-datasheet-157855877.pdf?src-supplier=TME; ComponentLink2Description: https://datasheet.octopart.com:443/0603WAF2202T5E-Royal-Ohm-datasheet-157855877.pdf?src-supplier=TME; ComponentLink3URL: https://datasheet.octopart.com:443/0603WAF2202T5E-Royal-Ohm-datasheet-62069544.pdf?src-supplier=TME; ComponentLink3Description: https://datasheet.octopart.com:443/0603WAF2202T5E-Royal-Ohm-datasheet-62069544.pdf?src-supplier=TME; Package: 0603; JLCPCB Part Number: C31850
R33 = 0603WAF4702T5E: Res Thick Film 0603 47K Ohm 1% 0.1W(1/10W) ±100ppm/C Pad SMD T/R; Manufacturer: Royal Ohm; Value: 47kΩ; Supplier: Mouser; Supplier Part Number: 303-0603WAF4702T5E; Manufacturer Part Number: 0603WAF4702T5E; Category: Uncategorized; Stock: 95000; Pricing: 10000=0.001 (USD); ComponentLink1URL: https://datasheet.octopart.com:443/0603WAF4702T5E-Royal-Ohm-datasheet-165785611.pdf?src-supplier=TME; ComponentLink1Description: https://datasheet.octopart.com:443/0603WAF4702T5E-Royal-Ohm-datasheet-165785611.pdf?src-supplier=TME; ComponentLink2URL: https://datasheet.octopart.com:443/0603WAF4702T5E-Royal-Ohm-datasheet-157855877.pdf?src-supplier=TME; ComponentLink2Description: https://datasheet.octopart.com:443/0603WAF4702T5E-Royal-Ohm-datasheet-157855877.pdf?src-supplier=TME; ComponentLink3URL: https://datasheet.octopart.com:443/0603WAF4702T5E-Royal-Ohm-datasheet-62069544.pdf?src-supplier=TME; ComponentLink3Description: https://datasheet.octopart.com:443/0603WAF4702T5E-Royal-Ohm-datasheet-62069544.pdf?src-supplier=TME; Package: 0603; JLCPCB Part Number: C25819
R36 = 0603WAF1502T5E: Thick Film Resistors - SMD RMC 0603 1/10W 1% T/R-5000; Manufacturer: Royal Ohm; Value: 15kΩ; Supplier: Mouser; Supplier Part Number: 303-0603WAF1502T5E; Manufacturer Part Number: 0603WAF1502T5E; Category: Uncategorized; Stock: 5000; Pricing: 10000=0.001 (USD); ComponentLink1URL: https://datasheet.octopart.com:443/0603WAF1502T5E-Royal-Ohm-datasheet-165785611.pdf?src-supplier=TME; ComponentLink1Description: https://datasheet.octopart.com:443/0603WAF1502T5E-Royal-Ohm-datasheet-165785611.pdf?src-supplier=TME; ComponentLink2URL: https://datasheet.octopart.com:443/0603WAF1502T5E-Royal-Ohm-datasheet-157855877.pdf?src-supplier=TME; ComponentLink2Description: https://datasheet.octopart.com:443/0603WAF1502T5E-Royal-Ohm-datasheet-157855877.pdf?src-supplier=TME; ComponentLink3URL: https://datasheet.octopart.com:443/0603WAF1502T5E-Royal-Ohm-datasheet-62069544.pdf?src-supplier=TME; ComponentLink3Description: https://datasheet.octopart.com:443/0603WAF1502T5E-Royal-Ohm-datasheet-62069544.pdf?src-supplier=TME; Package: 0603; JLCPCB Part Number: C22809
R38 = 0603WAF2702T5E: Thick Film Resistors - SMD RMC 0603 1/10W 1% T/R-5000; Manufacturer: Royal Ohm; Value: 27kΩ; Supplier: Mouser; Supplier Part Number: 303-0603WAF2702T5E; Manufacturer Part Number: 0603WAF2702T5E; Category: Uncategorized; Stock: 100000; Pricing: 10000=0.001 (USD); ComponentLink1URL: https://datasheet.octopart.com:443/0603WAF2702T5E-Royal-Ohm-datasheet-165785611.pdf?src-supplier=TME; ComponentLink1Description: https://datasheet.octopart.com:443/0603WAF2702T5E-Royal-Ohm-datasheet-165785611.pdf?src-supplier=TME; ComponentLink2URL: https://datasheet.octopart.com:443/0603WAF2702T5E-Royal-Ohm-datasheet-157855877.pdf?src-supplier=TME; ComponentLink2Description: https://datasheet.octopart.com:443/0603WAF2702T5E-Royal-Ohm-datasheet-157855877.pdf?src-supplier=TME; ComponentLink3URL: https://datasheet.octopart.com:443/0603WAF2702T5E-Royal-Ohm-datasheet-62069544.pdf?src-supplier=TME; ComponentLink3Description: https://datasheet.octopart.com:443/0603WAF2702T5E-Royal-Ohm-datasheet-62069544.pdf?src-supplier=TME; Package: 0603; JLCPCB Part Number: C22967
R39 = 0603WAF3000T5E: 100mW Thick Film Resistors 75V ±100ppm/℃ ±1% 300Ω 0603 Chip Resistor - Surface Mount ROHS; Manufacturer: Royal Ohm; Supplier: Mouser; Supplier Part Number: 303-0603WAF3000T5E; Manufacturer Part Number: 0603WAF3000T5E; Category: Uncategorized; Pricing: 10000=0.001 (USD); Value: 300Ω; ComponentLink1URL: https://datasheet.octopart.com:443/0603WAF3000T5E-Royal-Ohm-datasheet-165785611.pdf?src-supplier=TME; ComponentLink1Description: https://datasheet.octopart.com:443/0603WAF3000T5E-Royal-Ohm-datasheet-165785611.pdf?src-supplier=TME; ComponentLink2URL: https://datasheet.octopart.com:443/0603WAF3000T5E-Royal-Ohm-datasheet-157855877.pdf?src-supplier=TME; ComponentLink2Description: https://datasheet.octopart.com:443/0603WAF3000T5E-Royal-Ohm-datasheet-157855877.pdf?src-supplier=TME; ComponentLink3URL: https://datasheet.octopart.com:443/0603WAF3000T5E-Royal-Ohm-datasheet-62069544.pdf?src-supplier=TME; ComponentLink3Description: https://datasheet.octopart.com:443/0603WAF3000T5E-Royal-Ohm-datasheet-62069544.pdf?src-supplier=TME; Package: 0603; JLCPCB Part Number: C23025
S1 S2 = TS-1187A-B-A-B: SPST 50mA @ 12VDC Top Actuated Round Button 160gf SMD Tactile Switches RoHS; MP: TS-1187A-B-A-B; Value: *; Price: None; Package: None; Availability: Unavailable; JLCPCB Part Number: C318884
U1 = ESP32-S3-WROOM-1-N8R8: Bluetooth, WiFi 802.11b/g/n, Bluetooth v5.0 Transceiver Module 2.4GHz PCB Trace Surface Mount; pin to pad: 41>41_1+41_2+41_3+41_4+41_5+41_6+41_7+41_8+41_9+41_10+41_11+41_12+41_13+41_14+41_15+41_16+41_17+41_18+41_19+41_20+41_21; MF: Espressif Systems; Package: None; Price: None; Check_prices: https://www.snapeda.com/parts/ESP32-S3-WROOM-1-N8R8/Espressif+Systems/view-part/?ref=eda; Value: *; SnapEDA_Link: https://www.snapeda.com/parts/ESP32-S3-WROOM-1-N8R8/Espressif+Systems/view-part/?ref=snap; MP: ESP32-S3-WROOM-1-N8R8; Availability: In Stock; Purchase-URL: https://pricing.snapeda.com/search?q=ESP32-S3-WROOM-1-N8R8&ref=eda
U2 = MAX98357AETE+T: MAX98357A Series 5.5 V 3.2 W PCM Input Class D Audio Power Amplifier - TQFN-16; Manufacturer: Analog Devices; Manufacturer Lifecycle Status: PRODUCTION; Max Junction Temperature (Tj): 150°C; Max Output current: 1.6A; Max Output Power: 3.2W; Max Power Dissipation: 1.666W; Max Supply Voltage: 5.5V; Min Supply Voltage: 2.5V; Number of Channels: 1; Power Supply Rejection Ratio (PSRR): 77dB; Voltage Gain: 15dB; Supplier: Arrow Electronics; Supplier Part Number: MAX98357AETE+T; Manufacturer Part Number: MAX98357AETE+T; RoHS: Compliant; Category: Amplifiers - Audio; Stock: 25000; Pricing: 2500=1.79 (USD); Contact Plating: Tin; Height: 800µm; Lifecycle Status: Production; Max Operating Temperature: 85°C; Min Operating Temperature: -40°C; Mounting Technology: Surface Mount; Pins: 16; Output Power: 3.2W; Packaging: Tape & Reel; Radiation Hardening: No; Schedule B: 8542330000|8542330000|8542330000|8542330000|8542330000|8542330000|8542330000|8542330000|8542330000|8542330000|8542330000|8542330000|8542330000|8542330000|8542330000|8542330000|8542330000|8542330000|8542330000|8542330000|8542330000|8542330000|8542330000|85; ComponentLink1URL: https://octopart.com:443/opatz8j6/c1?t=yNMcU-XKDkN0o8xYTm6URhn_9nIMPsgQBI2xg8KwH08FPVC2Yp0oEBvhVJDvC8BH403lD25RLMIzjaHixokeavaTNiQVrExSZWvE8s6gsZaIo393pUunWghAhyc9gjbEdNTCGxTHPWBUsap5xi9Gu6gxJcYS-WroDv5vRs7YcAlmUrPds1qcg3g8cBoBcp6UucJZouH41N7pn-Wjuljw_0PJOBHrmdg4OBDFIBiilKuMmyQYrtQ3oepzhxq9wijavMwLeH-RY1-oKGgnQ6O4hL2jPF6tDAGh0ittBY25sJCSPs2FuKYzAUL7kSc&src-supplier=Analog+Devices; ComponentLink1Description: https://octopart.com:443/opatz8j6/c1?t=yNMcU-XKDkN0o8xYTm6URhn_9nIMPsgQBI2xg8KwH08FPVC2Yp0oEBvhVJDvC8BH403lD25RLMIzjaHixokeavaTNiQVrExSZWvE8s6gsZaIo393pUunWghAhyc9gjbEdNTCGxTHPWBUsap5xi9Gu6gxJcYS-WroDv5vRs7YcAlmUrPds1qcg3g8cBoBcp6UucJZouH41N7pn-Wjuljw_0PJOBHrmdg4OBDFIBiilKuMmyQYrtQ3oepzhxq9wijavMwLeH-RY1-oKGgnQ6O4hL2jPF6tDAGh0ittBY25sJCSPs2FuKYzAUL7kSc&src-supplier=Analog+Devices; ComponentLink2URL: https://datasheet.octopart.com:443/MAX98357AETE%2BT-Analog-Devices-datasheet-140103828.pdf?src-supplier=Upverter; ComponentLink2Description: https://datasheet.octopart.com:443/MAX98357AETE%2BT-Analog-Devices-datasheet-140103828.pdf?src-supplier=Upverter; ComponentLink3URL: https://datasheet.octopart.com:443/MAX98357AETE%2BT-Maxim-Integrated-datasheet-82537686.pdf?src-supplier=Upverter; ComponentLink3Description: https://datasheet.octopart.com:443/MAX98357AETE%2BT-Maxim-Integrated-datasheet-82537686.pdf?src-supplier=Upverter; ComponentLink4URL: https://sigma.octopart.com:443/141243535/technical_drawing/Maxim-Integrated-MAX98357AETE%2BT.pdf?src-supplier=Upverter; ComponentLink4Description: https://sigma.octopart.com:443/141243535/technical_drawing/Maxim-Integrated-MAX98357AETE%2BT.pdf?src-supplier=Upverter; ComponentLink5URL: https://datasheet.octopart.com:443/MAX98357AETE%2BT-Maxim-Integrated-datasheet-134531866.pdf?src-supplier=Augswan; ComponentLink5Description: https://datasheet.octopart.com:443/MAX98357AETE%2BT-Maxim-Integrated-datasheet-134531866.pdf?src-supplier=Augswan; ComponentLink6URL: https://sigma.octopart.com:443/140082349/technical_drawing/Maxim-Integrated-MAX98357AETE%2BT.pdf?src-supplier=ShanghaiCT; ComponentLink6Description: https://sigma.octopart.com:443/140082349/technical_drawing/Maxim-Integrated-MAX98357AETE%2BT.pdf?src-supplier=ShanghaiCT; ComponentLink7URL: https://datasheet.octopart.com/MAX98357AETE%2BT-Maxim-Integrated-datasheet-38886134.pdf; ComponentLink7Description: https://datasheet.octopart.com/MAX98357AETE%2BT-Maxim-Integrated-datasheet-38886134.pdf; ComponentLink8URL: https://datasheet.octopart.com:443/MAX98357AETE%2BT-Maxim-Integrated-datasheet-8516998.pdf?src-supplier=Future+Electronics; ComponentLink8Description: https://datasheet.octopart.com:443/MAX98357AETE%2BT-Maxim-Integrated-datasheet-8516998.pdf?src-supplier=Future+Electronics; ComponentLink9URL: http://sigma.octopart.com:80/conflict_mineral_statement/Analog-Devices-company-33.pdf?src-supplier=Compliance+Statements; ComponentLink9Description: http://sigma.octopart.com:80/conflict_mineral_statement/Analog-Devices-company-33.pdf?src-supplier=Compliance+Statements; ComponentLink10URL: http://sigma.octopart.com:80/reach_statement/Maxim-Integrated-company-67.pdf?src-supplier=Compliance+Statements; ComponentLink10Description: http://sigma.octopart.com:80/reach_statement/Maxim-Integrated-company-67.pdf?src-supplier=Compliance+Statements; ComponentLink11URL: http://sigma.octopart.com:80/rohs_statement/Maxim-Integrated-company-66.pdf?src-supplier=Compliance+Statements; ComponentLink11Description: http://sigma.octopart.com:80/rohs_statement/Maxim-Integrated-company-66.pdf?src-supplier=Compliance+Statements; ComponentLink12URL: http://sigma.octopart.com:80/conflict_mineral_statement/Maxim-Integrated-company-65.pdf?src-supplier=Compliance+Statements; ComponentLink12Description: http://sigma.octopart.com:80/conflict_mineral_statement/Maxim-Integrated-company-65.pdf?src-supplier=Compliance+Statements; ComponentLink13URL: https://octopart.com:443/opatz8j6/c1?t=Bv0f2BfoFwhohv0un7o9I76aj1Xgk1do5QHf943lLTAxTqEHx7lmJWxQapPRwJ1ZPM2rfGeu9eyIDRKCTRSszAJjc-Y6A6857H2kllxuKAe81eMTjIw00LDOIqYYt6JZWnfvf9QMGuM_YnFFat26XlcKCsZlKGoQx8nEl0G9eghXLw97whAUolrM5eqhMvKf2icvXdkOI4euicsOknz0zqGQGmH642O5ZZoYkcJIVnHvFIEPNikdwc4jUnCaVVIMlMAENlRaq6kb5gSh-48hbdm7PCRa_yqLfIkEbgV7REraBSXS9nqDSCO-wDo&src-supplier=Compliance+Statements; ComponentLink13Description: https://octopart.com:443/opatz8j6/c1?t=Bv0f2BfoFwhohv0un7o9I76aj1Xgk1do5QHf943lLTAxTqEHx7lmJWxQapPRwJ1ZPM2rfGeu9eyIDRKCTRSszAJjc-Y6A6857H2kllxuKAe81eMTjIw00LDOIqYYt6JZWnfvf9QMGuM_YnFFat26XlcKCsZlKGoQx8nEl0G9eghXLw97whAUolrM5eqhMvKf2icvXdkOI4euicsOknz0zqGQGmH642O5ZZoYkcJIVnHvFIEPNikdwc4jUnCaVVIMlMAENlRaq6kb5gSh-48hbdm7PCRa_yqLfIkEbgV7REraBSXS9nqDSCO-wDo&src-supplier=Compliance+Statements
U3 = CMP-1529-00004-3: IC MOTOR DRIVER PAR 16HTSSOP; Supply Current: 3mA; Max Output Current: 2A; Interface: PWM; Output Current: 1.5A; Max Supply Voltage: 10.8V; Fault Protection: Over Temperature; Number of Outputs: 2; Min Supply Voltage: 2.7V; Nominal Supply Current: 3mA; Series: DRV8833; Min Operating Temperature: -40°C; Package Quantity: 2000; Packaging: Tape and Reel; Case/Package: HTSSOP; Output Current per Channel: 1.5A; RoHS Compliant: Yes; RMS Current (Irms): 1.5A; Max Operating Temperature: 85°C; Technology: NMOS; Number of Pins: 16; Radiation Hardening: No; Lead Free: Lead Free; REACH SVHC: No SVHC; JLCPCB Part Number: C50506
U5 = 74HC165PW,118: 74HC Series 6 V 8-Bit Parallel-In/Serial Out Shift Register - TSSOP-16; Manufacturer: Nexperia; Manufacturer Lifecycle Status: RELEASED FOR SUPPLY; Clock Edge Trigger Type: Positive Edge; Direction: Unidirectional; Frequency: 20MHz; Load Capacitance: 50pF; Logic Function: OR, Shift Register; Max Supply Current: 50mA; Max Supply Voltage: 6V; Min Supply Voltage: 2V; Number of Bits: 8; Number of Circuits: 1; Number of Gates: 4; Number of Input Lines: 9; Operating Supply Voltage: 5V; Output Current: 5.2mA; Propagation Delay: 250ns; Quiescent Current: 8µA; Supplier: Avnet; Supplier Part Number: 74HC165PW,118; Manufacturer Part Number: 74HC165PW,118; RoHS: Compliant; Category: Shift Registers; Stock: 252500; Pricing: 2500=0.19757, 5000=0.19267, 10000=0.18992, 20000=0.18715, 40000=0.1844 (USD); Case/Package: TSSOP; China RoHS: Compliant; Contact Plating: Gold; Height - Seated (Max): 1.1mm; Harmonized Tariff Schedule (HTS) Code: 8542.39.00.01; Introduction Date: 1990-12-01; Lead Free: Lead Free; Length: 5mm; Lifecycle Status: Production; Max Operating Temperature: 125°C; Min Operating Temperature: -40°C; Mounting Technology: Surface Mount; Number of Bits per Element: 8; Number of Elements: 1; Number of Inputs: 8; Number of Output Lines: 1; Pins: 16; Number of Terminals: 16; Radiation Hardening: No; REACH SVHC: Yes; Schedule B: 8542390000, 8542390000|8542390000|8542390000|8542390000|8542390000; Temperature Grade: Automotive; Terminal Pitch: 650µm; Turn-On Delay Time: 250ns; Width: 4.4mm; ComponentLink1URL: https://datasheet.octopart.com:443/74HC165PW%2C118-Nexperia-datasheet-80324119.pdf?src-supplier=Augswan; ComponentLink1Description: https://datasheet.octopart.com:443/74HC165PW%2C118-Nexperia-datasheet-80324119.pdf?src-supplier=Augswan; ComponentLink2URL: https://datasheet.octopart.com:443/74HC165PW%2C118-Nexperia-datasheet-540822.pdf?src-supplier=IHS; ComponentLink2Description: https://datasheet.octopart.com:443/74HC165PW%2C118-Nexperia-datasheet-540822.pdf?src-supplier=IHS; ComponentLink3URL: https://datasheet.octopart.com:443/74HC165PW%2C118-Nexperia-datasheet-62067705.pdf?src-supplier=Newark; ComponentLink3Description: https://datasheet.octopart.com:443/74HC165PW%2C118-Nexperia-datasheet-62067705.pdf?src-supplier=Newark; ComponentLink4URL: https://datasheet.octopart.com:443/74HC165PW%2C118-Nexperia-datasheet-180922443.pdf?src-supplier=TME; ComponentLink4Description: https://datasheet.octopart.com:443/74HC165PW%2C118-Nexperia-datasheet-180922443.pdf?src-supplier=TME; ComponentLink5URL: https://datasheet.octopart.com:443/74HC165PW%2C118-NXP-Semiconductors-datasheet-12514615.pdf?src-supplier=element14+APAC; ComponentLink5Description: https://datasheet.octopart.com:443/74HC165PW%2C118-NXP-Semiconductors-datasheet-12514615.pdf?src-supplier=element14+APAC; ComponentLink6URL: https://datasheet.octopart.com:443/74HC165PW%2C118-NXP-Semiconductors-datasheet-15937044.pdf?src-supplier=iiiC; ComponentLink6Description: https://datasheet.octopart.com:443/74HC165PW%2C118-NXP-Semiconductors-datasheet-15937044.pdf?src-supplier=iiiC; ComponentLink7URL: http://sigma.octopart.com:80/reach_statement/NXP-Semiconductors-company-13.pdf?src-supplier=Compliance+Statements; ComponentLink7Description: http://sigma.octopart.com:80/reach_statement/NXP-Semiconductors-company-13.pdf?src-supplier=Compliance+Statements; ComponentLink8URL: http://sigma.octopart.com:80/rohs_statement/NXP-Semiconductors-company-12.pdf?src-supplier=Compliance+Statements; ComponentLink8Description: http://sigma.octopart.com:80/rohs_statement/NXP-Semiconductors-company-12.pdf?src-supplier=Compliance+Statements; JLCPCB Part Number: C80696
U6 = CMP-2000-05193-2: IMU ACCEL/GYRO I2C/SPI 14VFLGA; Manufacturer: STMicroelectronics; Sensor Type: Temperature,Accelerometer,Gyroscope; Gyro Range: 125/250/500/1000/2000°/s; Min Supply Voltage: 1.62V; Operating Supply Current: 9-900uA; Accel Range: 2/4/8/16g; Max Supply Voltage: 3.6V; Sensor Output: I2C,SPI; Package: LGA-14-DM00249496; Automotive: No; Height: 0.86mm; Temperature Range High: +85°C; Device Class L3: Inertial Measurement Units (IMUs); Device Class L2: Motion Sensors; Footprint Url: https://www.st.com/content/ccc/resource/technical/document/technical_note/73/17/9c/16/dd/96/4a/01/CD00134799.pdf/files/CD00134799.pdf/jcr:content/translations/en.CD00134799.pdf; Digikey Description: IMU ACCEL/GYRO I2C/SPI 14VFLGA; Mouser Description: LSM6DS3 Series 3.6 V ±2/±4/±8/±16 g 3D Accelerometer and 3D Gyroscope - LGA-14L; Manufacturer Part Number: LSM6DS3TR; Temperature Range Low: -40°C; RoHS: TRUE; ComponentLink2Description: Datasheet; Device Class L1: Sensors; Lead Free: Yes; Category: IC; Octopart: https://octopart.com/lsm6ds3tr-stmicroelectronics-53586202; Temperature: -40°C to +85°C; ComponentLink2URL: https://www.st.com/resource/en/datasheet/lsm6ds3.pdf; JLCPCB Part Number: C95230
U7 = CP2102N-A02-GQFN28R: Integrated Circuit Interface USB for UART Controller; 3-3.6V; -40+85 deg.C; SMD; QFN28; Manufacturer: Silicon Lab; Manufacturer Lifecycle Status: FULL PRODUCTION; Data Rate: 1.5Mbps; Max Junction Temperature (Tj): 105°C; Max Supply Voltage: 3.6V; Min Supply Voltage: 3V; Number of Digital IO: 7; Number of Ports: 1; Operating Supply Voltage: 3.3V; USB Standard: USB 2.0; Supplier: Arrow Electronics; Supplier Part Number: CP2102N-A02-GQFN28R; Manufacturer Part Number: CP2102N-A02-GQFN28R; RoHS: Compliant; Category: USB Interface ICs; Stock: 1500; Pricing: 1500=2.6814 (USD); Ambient Temperature Range High: 85°C; China RoHS: Compliant; Height: 800µm; Height - Seated (Max): 800µm; Harmonized Tariff Schedule (HTS) Code: 8542.31.00.30; Interface: UART; Introduction Date: 2019-03-12; Length: 5mm; Lifecycle Status: Production; Max Operating Temperature: 85°C; Min Operating Temperature: -40°C; Number of Terminals: 28; REACH SVHC: Yes; Schedule B: 8542390000, 8542390000|8542390000|8542390000|8542390000|8542390000; Temperature Grade: Industrial; Terminal Pitch: 500µm; Width: 5mm; ComponentLink1URL: https://datasheet.octopart.com:443/CP2102N-A02-GQFN28R-Silicon-Labs-datasheet-138898368.pdf?src-supplier=Augswan; ComponentLink1Description: https://datasheet.octopart.com:443/CP2102N-A02-GQFN28R-Silicon-Labs-datasheet-138898368.pdf?src-supplier=Augswan
U8 = CMP-0395-00503-2: Single Output LDO, 1 A, Fixed 3.3 V Output, 2 to 5.5 V Input, 4-pin SOT-223 (DCY), -40 to 125 degC, Green (RoHS & no Sb/Br); Manufacturer: Texas Instruments; Vout Adj(Min)(V): 3.3; Vdo(Typ)(mV): 1200; Iq(Typ)(mA): 0.05; Accuracy(%): 2; Iout(Max)(A): 1; SubFamily: Single Channel LDO; Vin(Max)(V): 5.5; PackageReference: DCY0004A; PackageDescription: 4-Pin Plastic Small Outline, Body 3.5 x 6.5 mm, Pitch 2.3 mm; Vout Adj(Max)(V): 3.3; Mounting Technology: Surface Mount; ComponentLink2Description: Datasheet; ComponentLink1Description: Manufacturer URL; PartNumber: TLV1117LV33DCYR; ComponentLink3Description: Package Specification; ComponentLink1URL: http://www.ti.com/; ComponentLink2URL: http://www.ti.com/general/docs/lit/getliterature.tsp?genericPartNumber=TLV1117LV33&fileType=pdf; Fixed Output Options(V): 3.3; PackageVersion: 4202506/B; Vin(Min)(V): 2; DatasheetVersion: SBVS160A; Eco-Plan: Green (RoHS & no Sb/Br); ComponentLink3URL: http://www.ti.com/litv/pdf/mpds094a; Code_JEDEC: TO-261
U9 = SY8205FCC: Manufacturer_Part_Number: SY8205FCC; Package: SOIC-8-EP; JLCPCB Part Number: C111875
U10 = CH334P: Integrated Circuit; Manufacturer_Name: WCH; Datasheet Link: https://jlcpcb.com/partdetail/WCH_Jiangsu_Qin_Heng-CH334P/C5373042; Height: 0.8mm; Manufacturer_Part_Number: CH334P; JLCPCB Part Number: C5373042
X1 = X322512MSB4SI: Crystal or Oscillator; Manufacturer_Name: Yangxing Tech; Datasheet Link: https://datasheet.lcsc.com/szlcsc/Yangxing-Tech-X322512MSB4SI_C9002.pdf; Height: 0.8mm; Manufacturer_Part_Number: X322512MSB4SI; JLCPCB Part Number: C9002
D1 D13 D15 = SS34: Package: SMA(DO-214AC); Price: None; Value: *; MP: SS34; Availability: Unavailable; JLCPCB Part Number: C8678